# Altium schematic sheet Connectivity.SchDoc
size A4; SheetNumber: 3; SheetTotal: 4
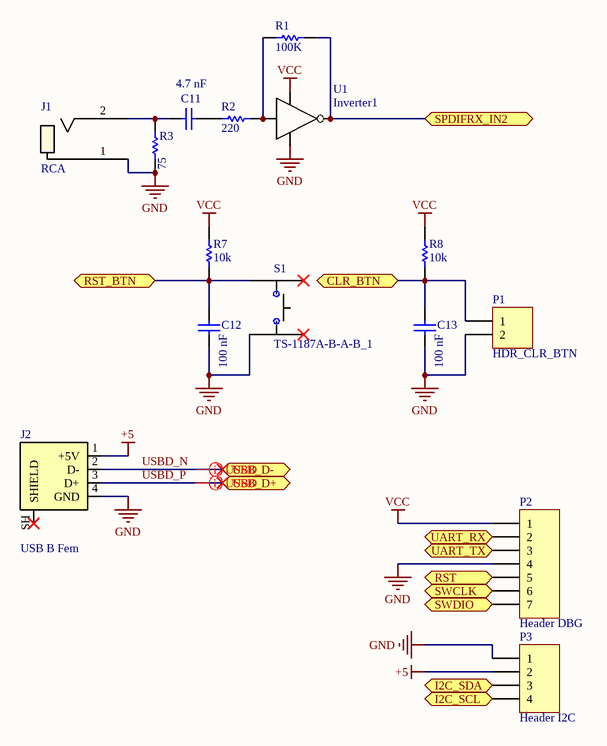
[diagram p0: Connectivity.SchDoc]

## Parts
C11  value 4.7 nF  [0402]  (hidden comment: C1538)
C12  value 100 nF  [0402]  (hidden comment: C1525)
C13  value 100 nF  [0402]  (hidden comment: C1525)
J1  RCA  [KLPX0848A2B]
J2  USB B Fem  [UJ2BH1TH]
P1  HDR_CLR_BTN  [HDR1X2]
P2  Header DBG  [HDR1X7]
P3  Header I2C  [HDR1X4]
R1  value 100K  [J1-0603]  (hidden comment: C25803)
R2  value 220  [J1-0603]  (hidden comment: C22962)
R3  value 75  [J1-0603]  (hidden comment: C4275)
R7  value 10k  [J1-0603]  (hidden comment: C25804)
R8  value 10k  [J1-0603]  (hidden comment: C25804)
S1  TS-1187A-B-A-B_1  [TS1187ABAB]
U1  Inverter1  [DBV5-M]

## Ports
CLR_BTN (bidir, see Top[2A], MCU[2B]), I2C_SCL (bidir, see Top[2A], MCU[2B]), I2C_SDA (bidir, see Top[2A], MCU[2C]), RST (bidir, see Top[2B], MCU[3C]), RST_BTN (bidir, see Top[2B], MCU[3B]), SPDIFRX_IN2 (bidir, see Top[2B], MCU[2B]), SWCLK (bidir, see Top[2B], MCU[2B]), SWDIO (bidir, see Top[2B], MCU[2B]), UART_RX (bidir, see Top[2B], MCU[2B]), UART_TX (bidir, see Top[2B], MCU[2B]), USB_D+ (bidir, see Top[2B], MCU[2B]), USB_D- (bidir, see Top[2B], MCU[2B])

## Nets
+5: J2.1(+5V) P3.2
GND: C12.1 C13.1 J1.1 J2.4(GND) P1.2 P2.4 P3.1 R3.1 S1.C1(NO_1) U1.3(GND)
VCC: P2.1 R7.1 R8.1 U1.5(VCC)
CLR_BTN: C13.2 P1.1 R8.2 ; port CLR_BTN
I2C_SCL: P3.4 ; port I2C_SCL
I2C_SDA: P3.3 ; port I2C_SDA
RST: P2.5 ; port RST
RST_BTN: C12.2 R7.2 S1.A1(COM_1) ; port RST_BTN
SPDIFRX_IN2: R1.1 U1.4(Y) ; port SPDIFRX_IN2
SWCLK: P2.6 ; port SWCLK
SWDIO: P2.7 ; port SWDIO
UART_RX: P2.2 ; port UART_RX
UART_TX: P2.3 ; port UART_TX
USBD_N: J2.2(D-) ; port USB_D-
USBD_P: J2.3(D+) ; port USB_D+
NetC11_1: C11.1 J1.2 R3.2
NetC11_2: C11.2 R2.2
NetR1_2: R1.2 R2.1 U1.2(A)

Not connected (* = marked no-connect by the designer): J2 SH(SHIELD)*; S1 B1(COM_2)* D1(NO_2)*

## Layout directives
differential pair: USBD_N, USBD_P

## Library data of the parts
C11-C13 = Cap: Capacitor; Published: 8-Jun-2000; LatestRevisionDate: 17-Jul-2002; LatestRevisionNote: Re-released for DXP Platform.; PackageReference: RAD-0.3; Publisher: Altium Limited; PackageDescription: Radial Cap, Thru-Hole; 2 Leads; 0.3 in Pin Spacing
J1 = KLPX-0848A-2-B: DNP; Mfr_Name: KYCON, INC.; Copyright: Copyright (C) 2023 Ultra Librarian. All rights reserved.; Manufacturer_Part_Number: KLPX-0848A-2-B; RefDes: RefDes; Type: DEV
J2 = USB B Fem: DNP; pin to pad: SH>MH
P1 = Header 2: Header, 2-Pin DNP; LatestRevisionDate: 17-Jul-2002; LatestRevisionNote: Re-released for DXP Platform.; Publisher: Altium Limited
P2 = Header 7: C492406; LatestRevisionDate: 17-Jul-2002; LatestRevisionNote: Re-released for DXP Platform.; Publisher: Altium Limited
P3 = Header 4: C6332197; LatestRevisionDate: 17-Jul-2002; LatestRevisionNote: Re-released for DXP Platform.; Publisher: Altium Limited
R1-R3 R7 R8 = Res1: Published: 8-Jun-2000; LatestRevisionDate: 17-Jul-2002; LatestRevisionNote: Re-released for DXP Platform.; PackageReference: AXIAL-0.3; Publisher: Altium Limited; PackageDescription: Axial Device, Thru-Hole; 2 Leads; 0.3 in Pin Spacing
S1 = TS-1187A-B-A-B_1: C318884; Manufacturer_Name: XKB Connectivity; Datasheet Link: http://www.helloxkb.com/public/images/pdf/TS-1187A-X-X-X.pdf; Height: 4.05mm; Manufacturer_Part_Number: TS-1187A-B-A-B
U1 = Inverter1: C81934; Supplier 1: Digi-Key; Supplier Part Number 1: 296-8487-1-ND